# EAGLE schematic Vent_BreakoutBord (EAGLE 9.6.2)
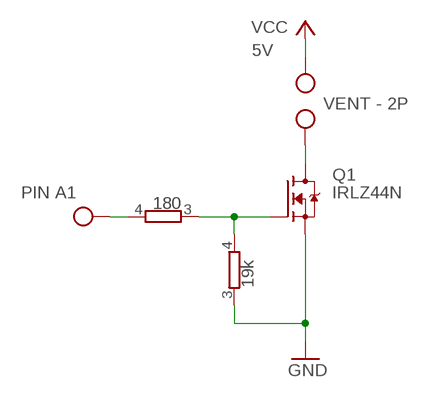
[diagram p0: schematic, sheet 1]

## Parts
Q1  IRLZ44N  [TO254P1054X469X1930-3]
RN1  19k  E2R  [SIL4]
RN2  180  E2R  [SIL4]

## Nets
GND: Q1.3(S) RN1.3
N$1: Q1.1(G) RN1.4 RN2.3
VCC: Q1.2(D) RN2.4
Unconnected: RN1.1 RN1.2 RN2.1 RN2.2

## Notes on the sheet
- 5V
- VENT - 2P
- PIN A1

## Library data of the parts
Q1 = IRLZ44N:IRLZ44N: 55V Single N-Channel HEXFET Power MOSFET in a TO-220AB package Check availability <https://pricing.snapeda.com/parts/IRLZ44N/Infineon%20/%20IR/view-part?ref=eda>; AVAILABILITY: In Stock; DESCRIPTION: N-Channel 55 V 47A (Tc) 3.8W (Ta), 110W (Tc) Surface Mount D2PAK; MF: Infineon / IR; MP: IRLZ44N; PACKAGE: TO-220-3 Infineon / IR; PRICE: None; PURCHASE-URL: https://pricing.snapeda.com/search/part/IRLZ44N/?ref=eda
RN1 RN2 = resistor-sil:E2R: SIL RESISTOR; OC_FARNELL: unknown; OC_NEWARK: unknown